# EAGLE board SBC_rev 3 (EAGLE 8.5.0)
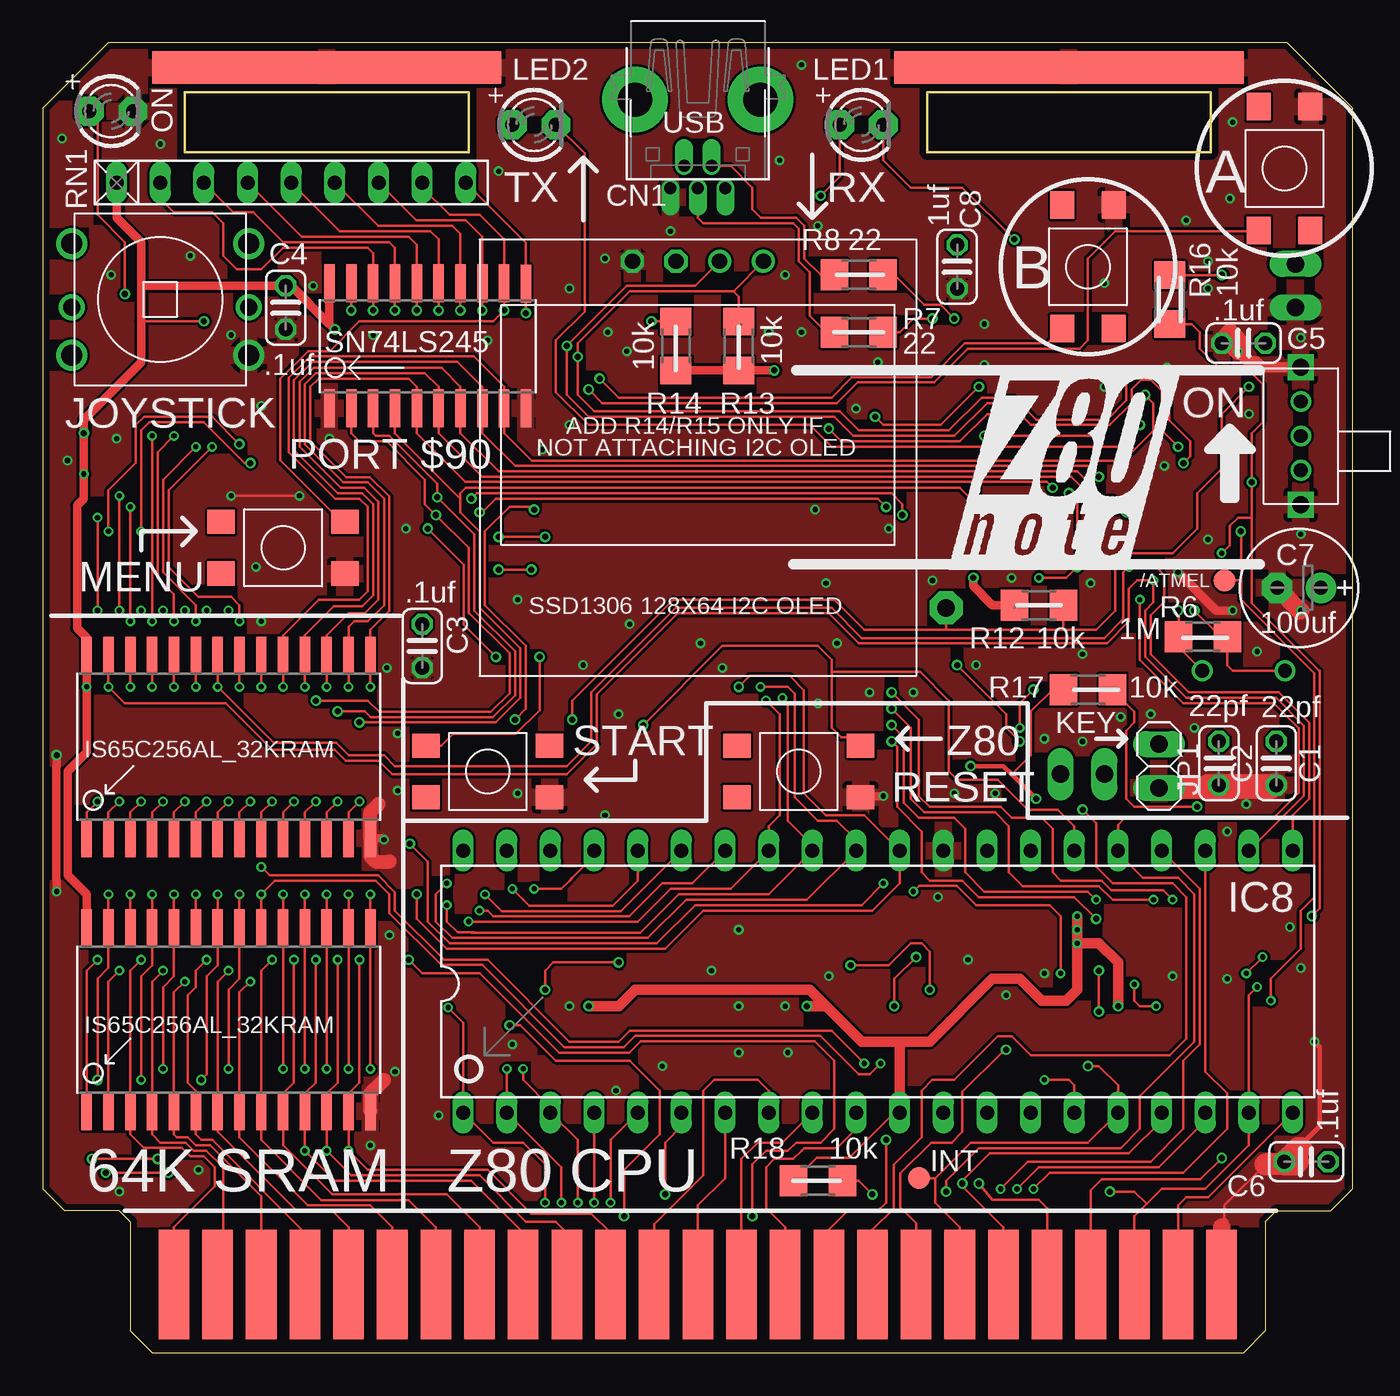
[diagram p2: board, top side]
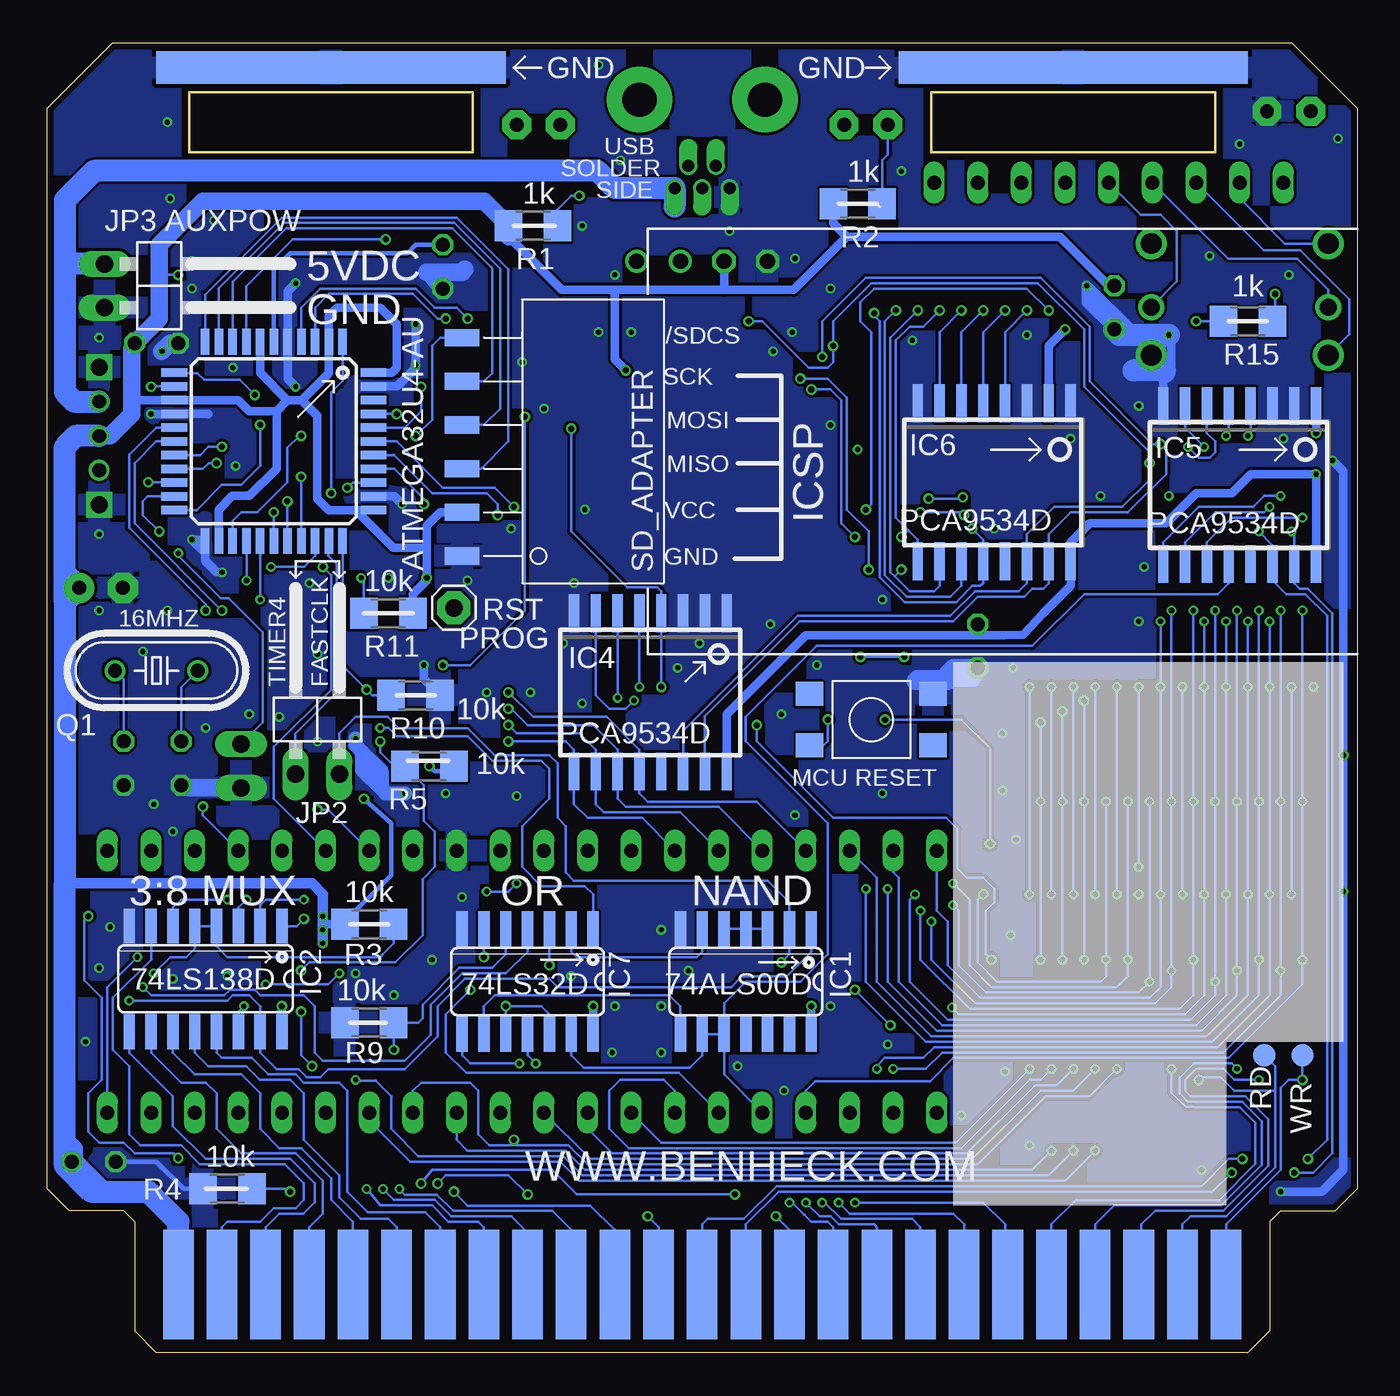
[diagram p3: board, bottom side, seen from below]

Size 76.2 x 76.2 mm. Coordinates in mm from the lower left corner, seen from the top.
Outline: 6.35,0 69.85,0 71.12,1.27 71.12,7.62 71.75,8.26 74.93,8.26 76.2,9.53 76.2,72.39 72.39,76.2 3.81,76.2 0,72.39 0,9.53 1.27,8.26 4.45,8.26 5.08,7.62 5.08,1.27 6.35,0
Outline: 8.26,69.85 24.77,69.85 24.77,73.34 8.26,73.34 8.26,69.85
Outline: 51.44,69.85 67.94,69.85 67.94,73.34 51.44,73.34 51.44,69.85
Copper layers (1*16): Top 0.035559375mm / dielectric 1.6mm / Bottom 0.035559375mm
Design rules "oshpark-2layer": minimum track width 6mil, minimum drill 10mil, track to track 6mil, track to pad 6mil, pad to pad 6mil, via to via 6mil, smd to smd 6mil, copper to edge 15mil, drill to drill 6mil, minimum pad ring 5mil, minimum via ring 5mil, stop-mask expansion 2.5mil, vias tented up to drill 0mil, thermal gap 10mil

## Footprints (pad centres in the part's own frame; a part is rotated, then mirrored left to right if it is on the bottom)
B1,27 = smd 1.27 x 1.27: TP 0,0
RESISTOR_C025-024X044 = drill 0.813 octagon: 1 -1.27,0; 2 1.27,0
E2,5-7 = drill 0.813 pad 1.778: + -1.27,0 | drill 0.813 pad 1.778 octagon: - 1.27,0
USB-MINIB-THM-MOLEX = drill 0.7 offset: D+ 0,9.72; D- -0.8,8.42; GND 1.6,9.72; ID 0.8,8.42; VBUS -1.6,9.72 | drill 2 pad 3.81: GND1 -3.65,4.57; GND4 3.65,4.57
SO14 = smd 0.66 x 2.032: 1 -3.81,-3.073; 2 -2.54,-3.073; 3 -1.27,-3.073; 4 0,-3.073; 5 1.27,-3.073; 6 2.54,-3.073; 7 3.81,-3.073; 8 3.81,3.073; 9 2.54,3.073; 10 1.27,3.073; 11 0,3.073; 12 -1.27,3.073; 13 -2.54,3.073; 14 -3.81,3.073
SO16 = smd 0.66 x 2.032: 1 -4.445,-3.073; 2 -3.175,-3.073; 3 -1.905,-3.073; 4 -0.635,-3.073; 5 0.635,-3.073; 6 1.905,-3.073; 7 3.175,-3.073; 8 4.445,-3.073; 9 4.445,3.073; 10 3.175,3.073; 11 1.905,3.073; 12 0.635,3.073; 13 -0.635,3.073; 14 -1.905,3.073; 15 -3.175,3.073; 16 -4.445,3.073
SO16W = smd 0.6 x 2.2: 1 -4.445,-4.6; 2 -3.175,-4.6; 3 -1.905,-4.6; 4 -0.635,-4.6; 5 0.635,-4.6; 6 1.905,-4.6; 7 3.175,-4.6; 8 4.445,-4.6; 9 4.445,4.6; 10 3.175,4.6; 11 1.905,4.6; 12 0.635,4.6; 13 -0.635,4.6; 14 -1.905,4.6; 15 -3.175,4.6; 16 -4.445,4.6
DIL40 = drill 0.813 long: 1 -24.13,-7.62; 2 -21.59,-7.62; 3 -19.05,-7.62; 4 -16.51,-7.62; 5 -13.97,-7.62; 6 -11.43,-7.62; 7 -8.89,-7.62; 8 -6.35,-7.62; 9 -3.81,-7.62; 10 -1.27,-7.62; 11 1.27,-7.62; 12 3.81,-7.62; 13 6.35,-7.62; 14 8.89,-7.62; 15 11.43,-7.62; 16 13.97,-7.62; 17 16.51,-7.62; 18 19.05,-7.62; 19 21.59,-7.62; 20 24.13,-7.62; 21 24.13,7.62; 22 21.59,7.62; 23 19.05,7.62; 24 16.51,7.62; 25 13.97,7.62; 26 11.43,7.62; 27 8.89,7.62; 28 6.35,7.62; 29 3.81,7.62; 30 1.27,7.62; 31 -1.27,7.62; 32 -3.81,7.62; 33 -6.35,7.62; 34 -8.89,7.62; 35 -11.43,7.62; 36 -13.97,7.62; 37 -16.51,7.62; 38 -19.05,7.62; 39 -21.59,7.62; 40 -24.13,7.62
1X02 = drill 1.016 long: 1 -1.27,0; 2 1.27,0
1X02/90 = drill 1.016 long: 1 -1.27,-3.81; 2 1.27,-3.81
LED3MM = drill 0.813 pad 1.676 octagon: A -1.27,0; K 1.27,0
HC49/S = drill 0.813: 1 -2.413,0; 2 2.413,0
R1206 = smd 1.6 x 1.803: 1 -1.422,0; 2 1.422,0
RN-9 = drill 0.813 long: 1 -10.16,0; 2 -7.62,0; 3 -5.08,0; 4 -2.54,0; 5 0,0; 6 2.54,0; 7 5.08,0; 8 7.62,0; 9 10.16,0
1X01 = drill 1.016 pad 1.93 octagon: 1 0,0
SD_RIGHTANGLE = smd 1 x 2: P$1 -6.35,0; P$2 -3.81,0; P$3 -1.27,0; P$4 1.27,0; P$5 3.81,0; P$6 6.35,0
CARD50 = smd 1.778 x 6.35: P$1 -30.48,-3.81; P$3 -27.94,-3.81; P$5 -25.4,-3.81; P$7 -22.86,-3.81; P$9 -20.32,-3.81; P$11 -17.78,-3.81; P$13 -15.24,-3.81; P$15 -12.7,-3.81; P$17 -10.16,-3.81; P$19 -7.62,-3.81; P$21 -5.08,-3.81; P$23 -2.54,-3.81; P$25 0,-3.81; P$27 2.54,-3.81; P$29 5.08,-3.81; P$31 7.62,-3.81; P$33 10.16,-3.81; P$35 12.7,-3.81; P$37 15.24,-3.81; P$39 17.78,-3.81; P$41 20.32,-3.81; P$43 22.86,-3.81; P$45 25.4,-3.81; P$47 27.94,-3.81; P$49 30.48,-3.81 | smd 1.778 x 6.35 bottom: P$2 -30.48,-3.81; P$4 -27.94,-3.81; P$6 -25.4,-3.81; P$8 -22.86,-3.81; P$10 -20.32,-3.81; P$12 -17.78,-3.81; P$14 -15.24,-3.81; P$16 -12.7,-3.81; P$18 -10.16,-3.81; P$20 -7.62,-3.81; P$22 -5.08,-3.81; P$24 -2.54,-3.81; P$26 0,-3.81; P$28 2.54,-3.81; P$30 5.08,-3.81; P$32 7.62,-3.81; P$34 10.16,-3.81; P$36 12.7,-3.81; P$38 15.24,-3.81; P$40 17.78,-3.81; P$42 20.32,-3.81; P$44 22.86,-3.81; P$46 25.4,-3.81; P$48 27.94,-3.81; P$50 30.48,-3.81
TQFP44 = smd 1.5 x 0.5: 1 -5.8,4; 2 -5.8,3.2; 3 -5.8,2.4; 4 -5.8,1.6; 5 -5.8,0.8; 6 -5.8,0; 7 -5.8,-0.8; 8 -5.8,-1.6; 9 -5.8,-2.4; 10 -5.8,-3.2; 11 -5.8,-4; 23 5.8,-4; 24 5.8,-3.2; 25 5.8,-2.4; 26 5.8,-1.6; 27 5.8,-0.8; 28 5.8,0; 29 5.8,0.8; 30 5.8,1.6; 31 5.8,2.4; 32 5.8,3.2; 33 5.8,4 | smd 0.5 x 1.5: 12 -4,-5.8; 13 -3.2,-5.8; 14 -2.4,-5.8; 15 -1.6,-5.8; 16 -0.8,-5.8; 17 0,-5.8; 18 0.8,-5.8; 19 1.6,-5.8; 20 2.4,-5.8; 21 3.2,-5.8; 22 4,-5.8; 34 4,5.8; 35 3.2,5.8; 36 2.4,5.8; 37 1.6,5.8; 38 0.8,5.8; 39 0,5.8; 40 -0.8,5.8; 41 -1.6,5.8; 42 -2.4,5.8; 43 -3.2,5.8; 44 -4,5.8
SO28-3 = smd 0.61 x 2.21: 1 -8.255,-5.315; 2 -6.985,-5.315; 3 -5.715,-5.315; 4 -4.445,-5.315; 5 -3.175,-5.315; 6 -1.905,-5.315; 7 -0.635,-5.315; 8 0.635,-5.315; 9 1.905,-5.315; 10 3.175,-5.315; 11 4.445,-5.315; 12 5.715,-5.315; 13 6.985,-5.315; 14 8.255,-5.315; 15 8.255,5.315; 16 6.985,5.315; 17 5.715,5.315; 18 4.445,5.315; 19 3.175,5.315; 20 1.905,5.315; 21 0.635,5.315; 22 -0.635,5.315; 23 -1.905,5.315; 24 -3.175,5.315; 25 -4.445,5.315; 26 -5.715,5.315; 27 -6.985,5.315; 28 -8.255,5.315
6MM_TACT = smd 1.6 x 1.4: P$1 -3.6,1.5; P$2 3.6,1.5; P$3 -3.6,-1.5; P$4 3.6,-1.5
GND_PADS = smd 20.32 x 1.905: P$1 0,0
OLED_128X64_I2C = drill 0.9 octagon: P$1 -3.81,-1.27; P$2 -1.27,-1.27 | drill 0.9: P$3 1.27,-1.27; P$4 3.81,-1.27
SKQUCAA010 = drill 1.2: COM 5.15,-3.25; DOWN -5.15,-3.25; P$4 5.15,3.25; UP -5.15,3.25 | drill 1: LEFT -5.15,-0.45; RIGHT 5.15,-0.45
SO20L = smd 0.61 x 2.21: 1 -5.715,-3.635; 2 -4.445,-3.635; 3 -3.175,-3.635; 4 -1.905,-3.635; 5 -0.635,-3.635; 6 0.635,-3.635; 7 1.905,-3.635; 8 3.175,-3.635; 9 4.445,-3.635; 10 5.715,-3.635; 11 5.715,3.61; 12 4.445,3.635; 13 3.175,3.635; 14 1.905,3.635; 15 0.635,3.635; 16 -0.635,3.635; 17 -1.905,3.635; 18 -3.175,3.635; 19 -4.445,3.635; 20 -5.715,3.635
SWITCH = drill 1 square: P$1 -4,0; P$5 4,0 | drill 0.8: P$2 -2,0; P$3 0,0; P$4 2,0

## Placement (x,y rotation side)
/ATMEL  TPB1,27  [B1,27]  68.74,44.93 0 top
C1  22pf  [RESISTOR_C025-024X044]  71.75,34.29 270 top
C2  22pf  [RESISTOR_C025-024X044]  68.42,34.29 270 top
C3  .1uf  [RESISTOR_C025-024X044]  22.07,41.12 270 top
C4  .1uf  [RESISTOR_C025-024X044]  14.13,60.8 270 top
C5  .1uf  [RESISTOR_C025-024X044]  69.85,58.74 180 top
C6  .1uf  [RESISTOR_C025-024X044]  73.5,11.11 180 top
C7  100uf  [E2,5-7]  73.08,44.5 180 top
C8  1uf  [RESISTOR_C025-024X044]  53.18,63.18 270 top
CN1  [USB-MINIB-THM-MOLEX]  38.1,77.47 180 top
IC1  74ALS00D  [SO14]  35.56,21.59 180 bottom
IC2  74LS138D  [SO16]  66.99,21.75 180 bottom
IC4  PCA9534D  [SO16W]  41.12,38.42 180 bottom
IC5  PCA9534D  [SO16W]  6.83,50.48 180 bottom
IC6  PCA9534D  [SO16W]  21.11,50.64 180 bottom
IC7  74LS32D  [SO14]  48.26,21.59 180 bottom
IC8  [DIL40]  48.58,21.59 0 top
INT  TPB1,27  [B1,27]  50.96,10.16 0 top
JP1  KEY  [1X02]  64.93,34.13 270 top
JP2  FASTCLK  [1X02/90]  60.48,37.47 0 bottom
JP3  [1X02/90]  69.06,62.07 270 bottom
LED1  [LED3MM]  47.62,71.44 0 top
LED2  [LED3MM]  28.57,71.44 0 top
ON  [LED3MM]  3.97,72.23 0 top
Q1  [HC49/S]  69.85,39.69 180 bottom
R1  1k  [R1206]  47.94,65.56 180 bottom
R2  1k  [R1206]  29.05,66.83 180 bottom
R3  10k  [R1206]  57.47,24.92 180 bottom
R4  10k  [R1206]  65.72,9.53 0 bottom
R5  10k  [R1206]  53.98,34.13 0 bottom
R6  1M  [R1206]  67.5,41.66 0 top
R7  22  [R1206]  47.47,59.37 0 top
R8  22  [R1206]  47.47,62.71 0 top
R9  10k  [R1206]  57.47,19.21 0 bottom
R10  10k  [R1206]  54.77,38.26 180 bottom
R11  10k  [R1206]  56.36,43.02 0 bottom
R12  10k  [R1206]  57.94,43.5 180 top
R13  10k  [R1206]  40.48,58.58 270 top
R14  10k  [R1206]  36.83,58.58 270 top
R15  1k  [R1206]  6.35,60.01 0 bottom
R16  10k  [R1206]  65.56,61.28 90 top
R17  10k  [R1206]  60.8,38.58 180 top
R18  10k  [R1206]  45.09,10 180 top
RD  TPB1,27  [B1,27]  5.4,17.3 0 bottom
RN1  [RN-9]  14.45,68.07 0 top
RST  PROG  [1X01]  52.55,43.34 0 bottom
SD_ADAPTER  SD_ADAPTER  [SD_RIGHTANGLE]  52.07,52.7 90 bottom
U$1  CARDSLOT50  [CARD50]  38.1,7.78 0 top
U$2  ATMEGA32U4-AU  [TQFP44]  63.02,53.02 270 bottom
U$3  IS65C256AL_32KRAM  [SO28-3]  10.79,19.37 0 top
U$4  IS65C256AL_32KRAM  [SO28-3]  10.79,35.24 0 top
U$5  TACT  [6MM_TACT]  25.88,33.81 0 top
U$6  TACT  [6MM_TACT]  13.97,46.83 0 top
U$7  TACT  [6MM_TACT]  60.8,63.18 90 top
U$8  TACT  [6MM_TACT]  72.23,68.9 90 top
U$9  GND_STRIP  [GND_PADS]  16.51,74.77 0 top
U$10  GND_STRIP  [GND_PADS]  59.69,74.77 0 top
U$11  GND_STRIP  [GND_PADS]  16.51,74.77 0 bottom
U$12  GND_STRIP  [GND_PADS]  59.69,74.77 0 bottom
U$13  OLED_SSD1306_I2C  [OLED_128X64_I2C]  38.1,64.77 0 top
U$14  SKQUCAA010  [SKQUCAA010]  6.83,61.28 0 top
U$15  [Z80LOGO]  52.7,45.56 0 top
U$16  SN74LS245  [SO20L]  22.38,58.58 0 top
U$17  TACT  [6MM_TACT]  43.97,33.81 0 top
U$18  SWITCH_1825232-1  [SWITCH]  73.18,53.34 90 top
U$19  TACT  [6MM_TACT]  28.26,36.83 180 bottom
WR  TPB1,27  [B1,27]  3.17,17.3 0 bottom

## Tracks (layer width: path | path; a pad name or v marks a point on that pad's centre or on a via)
$A0
  Bottom 0.152: IC2.13 66.36,17.46 66.04,17.14 64.29,17.14 63.34,16.19 61.75,16.19 61.28,15.72 59.21,15.72 58.74,15.24 58.74,9.37 57.55,8.18 54.21,8.18 53.34,7.3 U$1.P$38
$B0
  Bottom 0.152: IC2.12 67.63,17.46 66.83,16.66 64.62,16.66 63.83,15.88 62.07,15.88 61.28,15.08 61.28,12.38 59.21,10.32 59.21,9.04 57.96,7.78 56.36,7.78 55.88,7.3 U$1.P$40
$C0
  Bottom 0.152: IC2.11 68.9,17.46 67.63,16.19 64.93,16.19 63.82,15.08 63.82,13.02 62.71,11.91 61.44,11.91 59.69,10.16 59.69,8.89 58.42,7.62 U$1.P$42
$D0
  Bottom 0.152: IC2.10 70.17,17.46 68.42,15.72 66.99,15.72 66.36,15.08 66.36,13.02 64.93,11.59 61.75,11.59 60.17,10 60.17,8.1 60.96,7.3 U$1.P$44
$E0
  Bottom 0.152: IC2.9 71.44,17.46 68.9,14.92 68.9,13.18 66.99,11.27 62.07,11.27 60.66,9.86 60.66,8.76 61.32,8.1 62.71,8.1 63.5,7.3 U$1.P$46
$F0
  Bottom 0.152: IC2.7 70.17,22.86 72.39,20.64 72.39,17.62 71.44,16.67 71.44,12.7 70.8,12.06 68.42,12.06 67.32,10.97 62.39,10.97 61.28,9.86 61.28,8.89 61.75,8.41 63.02,8.41 63.82,7.62 65.72,7.62 66.04,7.3 U$1.P$48
/ATMELSERIAL  (via drill 0.3, 0.35)
  Top 0.152: v69.69,47.78 69.71,47.73 69.71,44.93 | v71.44,20.48 71.44,21.75 73.18,23.5 73.18,25.72 73.98,26.51 73.98,39.53 73.18,40.32 | 73.18,40.32 69.71,43.79 69.71,44.93 | /ATMEL.TP 69.71,44.93 | 73.18,40.32
  Bottom 0.152: IC1.1 31.75,23.34 33.19,21.89 35.79,21.89 36.41,21.27 46.51,21.27 46.99,21.75 51.91,21.75 53.5,20.16 53.5,18.41 55.42,16.5 59.86,16.5 60.33,16.03 61.12,16.03 61.58,16.5 62.85,16.5 63.82,17.46 IC2.15 63.82,20.16 64.45,20.8 65.41,20.8 65.72,20.48 v71.44,20.48 | v69.69,47.78 70.64,48.74 70.64,49.53 70.35,49.82 U$2.21
/BUSREQ  (via drill 0.3, 0.35)
  Top 0.152: v52.55,9.37 52.55,10 54.45,11.91 62.71,11.91 63.82,13.02 63.82,14.92 66.99,18.1 66.99,26.67 66.04,27.62 63.98,27.62 62.55,29.05 IC8.25 62.55,30.72 62.94,31.11 71.6,31.11 73.06,32.58 73.06,36.32 71.6,37.78 66.36,37.78 63.82,40.32 v63.82,43.81
  Bottom 0.152: v63.82,43.81 63.82,44.93 U$2.27 | U$1.P$30 43.18,7.14 43.19,7.14 44.61,8.56 51.74,8.56 v52.55,9.37
/BUTTONS  (via drill 0.3, 0.35)
  Top 0.152: U$16.19 v17.94,60.64 | v21.35,29.61 22.38,28.57 22.38,25.08 23.65,23.81 35.72,23.81 37.94,26.04 47.62,26.04 v48.9,27.3 | v28.57,49.05 28.42,49.21 27.15,49.21 25.72,47.78 25.72,43.5 28.1,41.12 28.1,37.47 v27.46,36.83 | v59.21,22.07 59.21,25.4 58.58,26.04 54.29,26.04 53.17,27.16 50.97,27.16 v50.64,26.83 | v63.5,21.43 63.5,20.48 63.82,20.16 v64.77,20.16
  Bottom 0.152: v28.57,49.05 28.26,49.37 28.26,59.37 28.89,60.01 28.89,61.12 28.1,61.91 19.21,61.91 v17.94,60.64 | v59.21,22.07 59.85,21.43 v63.5,21.43 | 49.29,26.91 v48.9,27.3 49.37,26.83 v50.64,26.83 | v64.77,20.16 65.09,19.84 IC2.14 | v27.46,36.83 23.02,36.83 21.35,35.16 v21.35,29.61
/HIGH32KRAM  (via drill 0.3)
  Top 0.152: U$3.20 v12.7,26.67 13.49,27.46 19.37,27.46 20.16,26.67 20.16,25.56 23.16,22.55 25.55,22.55 30.33,17.77 33.79,17.77 34.45,18.43 45.23,18.43 47.47,16.19 48.1,16.19 v48.74,16.83
  Bottom 0.152: IC7.8 52.07,17.3 51.59,16.83 v48.74,16.83
/IOREQ  (via drill 0.3)
  Top 0.152: v70.01,22.07 v70.96,23.02 | IC8.20 67.79,9.05 66.52,9.05 66.04,8.57 U$1.P$47
  Bottom 0.152: v70.96,23.02 72.71,21.27 IC8.20 | R3.1 56.05,23.81 56.67,23.18 56.83,23.02 65.72,23.02 66.36,23.65 IC2.4 IC2.5 67.63,23.5 68.1,23.02 69.06,23.02 v70.01,22.07
/LOW32KRAM  (via drill 0.3)
  Top 0.152: v12.7,38.73 U$4.20 | v47.78,16.83 45.88,18.73 34.13,18.73 33.5,18.1 30.63,18.1 25.88,22.85 25.56,22.86 23.34,22.86 20.48,25.72 20.48,26.78 19.49,27.77 13.19,27.77 v12.7,28.26
  Bottom 0.152: IC7.11 48.26,17.3 v47.78,16.83 | v12.7,28.26 v12.7,38.73
/LOW64K  (via drill 0.35)
  Top 0.152: v56.04,17.62 56.04,17.46 55.79,17.46 53.5,15.17 53.5,12.86 52.86,12.22 51.67,12.22 49.89,10.44 49.89,8.45 50.8,7.54 U$1.P$35
  Bottom 0.152: IC7.5 49.53,23.18 50.32,22.38 52.23,22.38 54.37,20.24 54.37,19.45 54.61,19.21 R9.2 v56.05,17.63 v56.04,17.62
/MREQ  (via drill 0.3, 0.35)
  Top 0.152: v70.64,21.27 70.17,20.8 IC8.19 70.17,12.06 67.63,9.53 65.09,9.53 64.21,8.65 | U$1.P$45 63.5,7.94 64.21,8.65 | v62.07,9.37 63.5,9.37 64.21,8.65
  Bottom 0.152: IC7.4 48.26,23.34 49.53,22.07 52.07,22.07 53.9,20.24 53.9,18.49 55.4,16.99 60.17,16.99 60.64,17.46 60.64,20.16 61.28,20.8 63.82,20.8 64.14,21.11 65.56,21.11 65.89,20.78 70.16,20.78 v70.64,21.27 | R4.2 62.23,9.53 v62.07,9.37
/SDCS  (via drill 0.35)
  Top 0.152: v54.77,53.34 v61.44,53.34
  Bottom 0.152: U$2.25 65.42,48.4 64.93,48.9 63.98,48.9 62.23,50.64 62.23,52.64 61.53,53.34 v61.44,53.34 | v54.77,53.34 53.82,54.29 53.82,58.58 53.34,59.05 SD_ADAPTER.P$6
A  (via drill 0.35)
  Top 0.152: RN1.6 19.49,65.56 23.81,65.56 24.29,65.09 U$16.14 v24.29,60.64 | v31.75,56.04 32.54,55.24 46.2,55.24 47.4,56.45 51.84,56.45 53.81,58.41 60.33,58.41 60.8,58.89 60.8,62.71 60.8,63.66 61.75,64.61 | v29.21,47.47 v26.51,47.47 26.35,47.62 | U$8.P$1 70.68,65.25 62.39,65.25 61.75,64.61 | 61.75,64.61
  Bottom 0.152: IC6.9 25.56,47.31 26.11,47.86 | v24.29,60.64 25.24,59.69 26.04,59.69 26.83,58.9 26.83,48.58 26.11,47.86 | v31.75,56.04 30.64,56.04 30,55.4 30,48.26 v29.21,47.47 | 26.11,47.86 v26.51,47.47
A0  (via drill 0.3, 0.35)
  Top 0.152: v14.61,32.07 13.97,31.43 U$4.10 | v14.61,22.86 14.61,15.72 13.97,15.08 U$3.10 13.97,12.06 16.83,9.21 23.5,9.21 25.4,7.3 U$1.P$15 | v21.75,26.67 21.75,25.24 23.5,23.5 36.2,23.5 38.42,25.72 48.26,25.72 49.85,27.3 IC8.30 47.78,31.27 45.54,31.27 44.27,32.54 44.27,38.55 43.45,39.37 41.12,39.37 v40.48,38.73 | v55.88,54.61 54.93,54.61 53.34,53.02 46.46,53.02 v45.72,53.76
  Bottom 0.152: v14.61,32.07 v14.61,22.86 14.61,21.91 14.92,21.59 20.95,21.59 22.07,22.7 22.07,26.35 v21.75,26.67 | v40.48,38.73 IC4.4 40.48,44.29 40.72,44.53 42.47,44.53 45.72,47.78 v45.72,53.76 | U$2.41 55.89,54.62 v55.88,54.61
A1  (via drill 0.3)
  Top 0.152: v13.34,22.86 12.7,22.23 U$3.9 12.7,12.38 16.2,8.88 21.29,8.88 22.86,7.3 U$1.P$13 | v13.34,32.07 12.7,31.43 U$4.9 | v23.5,27.3 22.86,26.67 22.86,25.08 23.81,24.13 35.2,24.13 37.42,26.35 44.45,26.35 IC8.31 47.31,29.84 46.2,30.96 45.09,30.96 43.74,32.31 43.74,38.34 43.34,38.73 v41.75,38.73
  Bottom 0.152: v13.34,32.07 v13.34,22.86 13.34,21.91 13.97,21.27 21.27,21.27 22.54,22.54 22.54,26.35 v23.5,27.3 | IC4.5 v41.75,38.73
A2  (via drill 0.3)
  Top 0.152: v12.06,21.59 11.43,20.95 U$3.8 11.43,12.54 15.4,8.57 19.05,8.57 20.32,7.3 U$1.P$11 | U$4.8 11.43,31.43 v12.06,32.07 | v23.5,26.04 23.5,25.08 24.13,24.45 24.92,24.45 | v43.02,38.1 43.34,37.78 43.34,30.96 44.77,29.53 IC8.32 42.23,26.67 36.99,26.67 34.75,24.43 24.94,24.43 24.92,24.45 | 25.08,24.45 24.92,24.45
  Bottom 0.152: v12.06,32.07 v12.06,21.59 12.7,20.95 21.59,20.95 23.18,22.54 23.18,25.72 v23.5,26.04 | IC4.6 v43.02,38.1
A3  (via drill 0.3)
  Top 0.152: v10.79,22.23 10.16,21.59 U$3.7 10.16,12.86 14.76,8.26 16.83,8.26 17.78,7.3 U$1.P$9 17.78,6.99 | v10.79,32.07 10.16,31.43 U$4.7 | v42.07,37.94 42.86,37.15 42.86,31.27 42.23,30.64 IC8.33 40.01,26.99 36.51,26.99 34.61,25.08 v24.77,25.08
  Bottom 0.152: v10.79,43.18 v10.79,32.07 v10.79,22.23 10.79,21.27 11.75,20.32 22.23,20.32 24.77,22.86 v24.77,25.08 | IC4.7 44.29,38.26 43.5,37.47 42.55,37.47 v42.07,37.94
A4  (via drill 0.3, 0.35)
  Top 0.152: v9.53,22.86 8.89,22.23 8.89,21.27 8.41,20.8 8.41,15.72 8.89,15.24 U$3.6 8.89,12.7 9.21,12.38 9.84,12.38 15.24,6.99 U$1.P$7 | v9.53,32.07 8.89,31.43 U$4.6 | IC8.34 37.78,27.3 36.04,27.3 34.12,25.39 26.19,25.39 25.86,25.72 v25.4,25.72 | v49.37,35.56 49.69,35.24 49.69,31.75 51.12,30.32 51.12,27.94 51.59,27.46 53.5,27.46 54.45,26.51 60.01,26.51 v61.28,25.24
  Bottom 0.152: v25.4,25.72 25.4,22.86 22.54,20 10.32,20 9.53,20.8 v9.53,22.86 v9.53,32.07 v9.53,43.18 | IC8.34 41.59,31.11 44.77,31.11 45.56,31.91 IC4.9 45.56,35.08 46.04,35.56 v49.37,35.56 | IC2.1 61.7,24.82 v61.28,25.24
A5  (via drill 0.3, 0.35)
  Top 0.152: v8.26,21.59 7.62,20.95 U$3.5 7.62,12.7 7.78,12.54 8.41,12.54 8.89,12.06 9.73,12.06 12.7,9.09 U$1.P$5 | v8.26,32.07 7.62,31.43 U$4.5 | v61.28,26.35 60.8,26.83 54.77,26.83 53.66,27.94 53.66,30.48 53.02,31.11 50.96,31.11 50.09,31.99 50.09,35.8 v49.37,36.51 | v25.72,26.67 26.7,25.69 33.63,25.69 IC8.35
  Bottom 0.152: v25.72,26.67 26.04,26.35 26.04,21.59 23.81,19.37 9.68,19.37 8.26,20.8 v8.26,21.59 v8.26,32.07 v8.26,43.18 | IC8.35 39.37,31.43 43.81,31.43 44.29,31.91 IC4.10 44.29,35.08 45.24,36.04 48.9,36.04 v49.37,36.51 | v61.28,26.35 63.5,26.35 63.82,26.04 IC2.2
A6  (via drill 0.3, 0.35)
  Top 0.152: v6.99,22.23 6.35,21.59 U$3.4 6.35,12.7 6.83,12.22 8.3,12.22 8.76,11.76 9.51,11.76 10.48,10.79 10.48,4.29 U$1.P$3 | v6.99,32.07 6.35,31.43 U$4.4 | v49.37,37.47 50.48,36.35 50.48,32.23 51.28,31.43 55.4,31.43 56.2,30.64 56.2,27.94 56.99,27.15 61.44,27.15 62.23,26.35 v64.61,26.35 | IC8.36 34.61,27.46 33.14,26 28.3,26 27.94,26.35 v27.3,26.99
  Bottom 0.152: v27.3,26.99 27.3,21.59 24.45,18.73 9.05,18.73 6.99,20.8 v6.99,22.23 v6.99,32.07 v6.99,43.18 | IC8.36 37.15,31.75 42.55,31.75 43.02,32.23 IC4.11 43.02,35.08 44.45,36.51 48.26,36.51 49.21,37.47 v49.37,37.47 | v64.61,26.35 65.09,25.88 IC2.3
A7  (via drill 0.3, 0.35)
  Top 0.152: v5.71,22.86 5.08,22.23 U$3.3 5.08,12.7 5.86,11.92 8.08,11.92 8.57,11.43 9.37,11.43 10,10.79 10,9.68 7.62,7.3 U$1.P$1 | v5.71,32.07 5.08,31.43 U$4.3 | IC8.37 32.07,28.89 30.8,27.62 30.64,27.46 | v28.57,26.99 30.16,26.99 30.64,27.46 | v49.37,38.42 50.96,36.83 50.96,32.38 51.59,31.75 55.72,31.75 56.36,31.11 58.1,31.11 58.74,30.48 58.74,27.94 59.21,27.46 61.59,27.46 62.15,26.91 65.17,26.91 v65.72,26.35 | 30.64,27.46
  Bottom 0.152: v28.57,26.99 28.57,21.59 25.08,18.1 8.41,18.1 5.71,20.8 v5.71,22.86 v5.71,32.07 v5.71,43.18 | IC8.37 34.92,32.07 41.27,32.07 41.75,32.54 IC4.12 41.75,35.08 43.66,36.99 47.94,36.99 v49.37,38.42 | IC2.6 68.9,25.88 68.42,26.35 v65.72,26.35
A8  (via drill 0.3)
  Top 0.152: v6.35,26.67 U$3.25 6.35,22.54 5.71,21.91 v5.71,15.88 | v6.35,38.73 U$4.25 | v6.35,42.55 v6.35,53.34
  Bottom 0.152: IC8.38 27.94,27.62 27.94,21.59 24.77,18.41 8.73,18.41 6.35,20.8 v6.35,26.67 v6.35,38.73 v6.35,42.55 | v6.35,53.34 6.19,53.5 IC5.4 | v5.71,15.88 7.14,15.88 7.78,16.51 9.37,16.51 10,15.88 10,15.24 9.68,14.92 6.51,14.92 5.16,13.57 5.16,10.87 7.78,8.26 11.75,8.26 12.54,7.46 12.54,4.13 U$1.P$6
A9  (via drill 0.3)
  Top 0.152: v7.62,26.67 U$3.24 7.62,21.91 6.99,21.27 v6.99,16.51 | v7.62,38.73 U$4.24 | v7.62,42.55 7.62,44.13 6.67,45.09 6.67,52.39 v7.62,53.34
  Bottom 0.152: IC8.39 26.99,27.94 26.67,27.62 26.67,21.59 24.13,19.05 9.37,19.05 7.62,20.8 v7.62,26.67 v7.62,38.73 v7.62,42.55 | v7.62,53.34 7.46,53.5 IC5.5 | v6.99,16.51 7.3,16.83 9.53,16.83 9.53,16.78 10.31,16 10.31,15.09 10.32,15.08 9.84,14.61 6.67,14.61 5.53,13.47 5.53,10.93 7.89,8.57 14.13,8.57 15.24,7.46 U$1.P$8
A10  (via drill 0.3)
  Top 0.152: v11.43,26.67 U$3.21 11.43,21.75 10.79,21.11 v10.79,16.51 | U$4.21 v11.43,38.73 | v11.43,42.55 11.43,43.5 10.95,43.97 9.05,43.97 7.32,45.71 7.32,50.18 v9.84,52.7
  Bottom 0.152: IC8.40 24.45,25.72 23.81,25.08 23.81,22.54 21.91,20.64 12.06,20.64 11.43,21.27 v11.43,26.67 v11.43,38.73 v11.43,42.55 | v9.84,52.7 9.21,52.07 8.57,52.07 8.26,52.39 8.26,53.02 8.73,53.5 IC5.6 | U$1.P$10 17.78,7.46 16.36,8.88 8.02,8.88 5.91,10.99 5.91,13.37 6.83,14.29 9.53,14.29 9.54,14.3 9.97,14.3 10.79,15.13 v10.79,16.51
A11  (via drill 0.3)
  Top 0.152: U$3.23 v8.89,26.67 | v8.89,38.73 U$4.23 | v8.89,42.55 8.89,43.5 6.99,45.4 6.99,50.8 v8.89,52.7 | v23.57,20.08 24.45,19.21 IC8.1 26.19,12.22 27.94,12.22 29.21,10.95 v29.21,8.73
  Bottom 0.152: v8.89,42.55 v8.89,38.73 v8.89,26.67 8.89,20.8 10,19.68 23.18,19.68 v23.57,20.08 | v8.89,52.7 10,53.82 IC5.7 | 29.05,8.73 v29.21,8.73 21.75,8.73 20.48,7.46 20.48,4.13 U$1.P$12
A12  (via drill 0.3)
  Top 0.152: U$3.2 3.81,21.59 v4.45,22.23 | v4.45,32.07 3.81,31.43 U$4.2 | v26.99,16.51 IC8.2 30.16,10.79 v30.16,8.73 | v4.45,49.85 v4.45,43.18
  Bottom 0.152: v4.45,43.18 v4.45,32.07 v4.45,22.23 4.45,20.8 7.78,17.46 24.13,17.46 25.08,16.51 v26.99,16.51 | IC5.9 11.27,47.15 9.21,49.21 6.03,49.21 5.4,49.85 v4.45,49.85 | v30.16,8.73 29.53,8.1 23.5,8.1 22.86,7.46 U$1.P$14
A13  (via drill 0.3)
  Top 0.152: U$3.26 v5.08,26.67 | v5.08,38.73 U$4.26 | v27.94,16.51 27.94,15.88 29.53,14.29 IC8.3 31.11,12.38 v31.11,8.73 | v5.08,49.21 v5.08,42.55
  Bottom 0.152: v5.08,42.55 v5.08,38.73 v5.08,26.67 5.08,20.8 8.1,17.78 24.61,17.78 25.24,17.14 27.46,17.14 27.94,16.67 v27.94,16.51 | IC5.10 10,47.15 8.26,48.9 5.4,48.9 v5.08,49.21 | v31.11,8.73 30.96,8.73 30,7.78 25.88,7.78 25.4,7.3 U$1.P$16
A14  (via drill 0.3)
  Top 0.152: U$3.1 2.54,22.23 v3.17,22.86 | U$4.1 2.54,31.43 v3.17,32.07 | IC8.4 v32.07,8.73 | v3.17,48.58 v3.17,43.18
  Bottom 0.152: IC8.4 32.07,15.24 31.51,15.8 24.84,15.8 23.5,17.14 7.46,17.14 3.17,21.43 v3.17,22.86 v3.17,32.07 v3.17,43.18 | IC5.11 8.73,47.15 7.3,48.58 v3.17,48.58 | v32.07,8.73 31.26,7.92 30.63,7.92 30.16,7.46 28.1,7.46 27.94,7.3 U$1.P$18
A15  (via drill 0.3)
  Top 0.152: IC8.5 33.02,12.38 v33.02,8.73
  Bottom 0.152: U$1.P$20 30.48,7.3 30.8,7.62 31.75,7.62 32.15,8.03 | 32.15,8.03 32.13,8.01 | IC1.10 IC1.9 38.1,17.3 38.83,16.58 44.99,16.58 45.72,17.3 IC7.13 | IC1.10 36.83,16.19 IC8.5 | IC5.12 7.46,44.77 8.1,44.13 15.88,44.13 18.89,41.12 31.43,41.12 35.56,36.99 35.56,35.56 30.8,30.8 30.8,23.18 32.38,21.59 35.56,21.59 36.83,20.32 IC1.10 | v33.02,8.73 32.86,8.73 32.15,8.03
B  (via drill 0.35)
  Top 0.152: RN1.7 21.72,65.88 24.61,65.88 25.56,64.93 U$16.13 v25.56,60.64 | U$7.P$1 58.44,58.72 53.64,58.72 51.67,56.75 47.07,56.75 45.88,55.56 33.5,55.56 v32.38,56.67 | v28.42,45.56 v26.51,45.56
  Bottom 0.152: v25.56,60.64 27.15,59.05 27.15,45.4 26.91,45.16 | 26.91,45.16 26.04,44.29 24.61,44.29 24.29,44.61 IC6.10 | v32.38,56.67 30.8,56.67 29.69,55.56 29.69,49.05 28.42,47.78 v28.42,45.56 | v26.51,45.56 26.91,45.16
BUSAK  (via drill 0.3)
  Top 0.152: v57.63,9.53 58.58,10.48 66.36,10.48 68.9,13.02 68.9,15.08 67.63,16.35 IC8.23
  Bottom 0.152: U$1.P$36 50.8,7.3 51.12,7.62 52.86,7.62 53.82,8.57 56.83,8.57 v57.63,9.53
D0  (via drill 0.3, 0.35)
  Top 0.152: U$4.11 15.24,31.43 v15.88,32.07 | U$1.P$17 27.94,6.99 24.92,10 16.99,10 v15.24,11.75 U$3.11 15.24,15.08 15.88,15.72 v15.88,22.86 | U$16.2 17.94,53.5 18.41,53.02 20,53.02 22.23,50.8 22.23,49.37 v22.86,48.74 24.78,46.82 24.78,43.02 24.81,43.02 27.15,40.69 27.15,38.37 26.05,37.28 19.55,37.28 18.89,37.94 v15.88,37.94 | v25.4,48.9 25.56,48.9 26.35,49.69 48.58,49.69 v49.05,49.21
  Bottom 0.152: v15.88,22.86 v15.88,32.07 v15.88,37.94 15.88,38.1 | v15.24,11.75 16.99,10 45.24,10 46.35,11.11 55.09,11.11 57.47,13.49 IC8.14 | v22.86,48.74 v22.87,48.74 23.03,48.9 v25.4,48.9 | U$2.39 55.88,53.02 53.18,50.32 50.16,50.32 v49.05,49.21
D1  (via drill 0.3, 0.35)
  Top 0.152: v17.14,32.07 16.51,31.43 U$4.12 | U$1.P$19 30.48,6.99 29.84,7.62 28.1,7.62 25.4,10.32 17.94,10.32 v16.51,11.75 U$3.12 16.51,15.08 17.14,15.72 v17.14,22.86 | v58.26,15.88 59.69,15.88 60.01,15.56 IC8.15 | U$16.3 19.21,53.5 19.37,53.34 20.16,53.34 22.94,50.56 v22.94,49.77 25.08,47.62 25.08,43.18 27.46,40.8 27.46,38.26 26.18,36.98 19.06,36.98 18.73,37.31 v17.14,37.31 | v24.92,49.69 25.24,50.01 49.37,50.01 50.01,49.37 v50.01,48.74
  Bottom 0.152: v17.14,22.86 v17.14,32.07 v17.14,37.31 | v16.51,11.75 17.94,10.32 45.09,10.32 46.2,11.43 54.61,11.43 56.2,13.02 56.2,14.92 57.09,15.81 58.13,15.81 v58.26,15.88 | v22.94,49.77 23.02,49.69 v24.92,49.69 | U$2.38 56.05,52.22 56.04,52.23 53.82,50.01 50.64,50.01 50.01,49.37 v50.01,48.74
D2  (via drill 0.3, 0.35)
  Top 0.152: v18.41,32.07 17.78,31.43 U$4.13 | U$1.P$21 33.02,6.99 31.91,8.1 28.42,8.1 25.88,10.64 18.89,10.64 v17.78,11.75 U$3.13 17.78,15.08 18.41,15.72 v18.41,22.86 | U$16.4 20.48,53.5 24.29,49.69 | v54.29,49.37 53.34,50.32 24.61,50.32 24.29,50.01 24.29,49.69 | v18.41,36.67 26.35,36.67 27.78,38.1 27.78,40.97 25.41,43.34 25.41,47.77 24.29,48.9 24.29,49.69
  Bottom 0.152: v18.41,22.86 v18.41,32.07 v18.41,36.67 | v17.78,11.75 18.89,10.64 44.93,10.64 46.05,11.76 51.77,11.76 52.39,12.38 IC8.12 | U$2.37 56.03,51.42 54.29,49.69 v54.29,49.37
D3  (via drill 0.3, 0.35)
  Top 0.152: v19.05,26.67 U$3.15 v19.05,16.51 | v19.05,38.73 U$4.15 19.05,42.07 20.15,43.17 20.15,49.81 19.02,50.95 17.63,50.95 15.56,53.02 15.56,56.2 16.03,56.67 21.27,56.67 21.75,56.2 U$16.5 21.75,53.5 24.58,50.67 58.4,50.67 v58.74,50.32 | 35.56,6.99 U$1.P$23 35.56,7.46 38.42,10.32 38.42,15.24 39.05,15.88 41.59,15.88 42.23,15.24 IC8.8
  Bottom 0.152: v19.05,26.67 v19.05,38.73 | v19.05,16.51 23.34,12.22 40.48,12.22 IC8.8 | v58.74,50.32 58.44,50.62 U$2.36
D4  (via drill 0.3, 0.35)
  Top 0.152: v17.78,26.67 U$3.16 v17.78,16.51 | v17.78,38.73 U$4.16 17.78,42.23 18.1,42.55 18.89,42.55 19.84,43.5 19.84,49.69 18.89,50.64 17.46,50.64 15.24,52.86 15.24,56.36 15.88,56.99 22.23,56.99 23.02,56.2 U$16.6 23.02,53.5 25.55,50.97 59.84,50.97 61.91,48.9 v63.02,48.9 | 38.1,6.67 U$1.P$25 38.1,8.57 39.69,10.16 IC8.7
  Bottom 0.152: v17.78,26.67 v17.78,38.73 | IC8.7 39.69,15.24 40.32,15.88 42.86,15.88 43.5,15.24 43.5,13.02 42.39,11.91 23.02,11.91 19.05,15.88 18.41,15.88 v17.78,16.51 | U$2.28 v63.02,48.9
D5  (via drill 0.3, 0.35)
  Top 0.152: v16.51,26.67 U$3.17 v16.51,16.51 | v16.51,38.73 U$4.17 16.51,41.75 17.78,43.02 18.73,43.02 19.51,43.8 19.51,49.5 18.7,50.31 17.33,50.31 14.94,52.7 14.94,56.48 15.75,57.3 23.19,57.3 24.29,56.2 U$16.7 24.29,53.5 26.51,51.28 60.17,51.28 61.91,49.53 v62.23,49.53 | IC8.9 43.02,12.22 41.59,12.22 40.64,11.27 U$1.P$27
  Bottom 0.152: v16.51,26.67 v16.51,38.73 | IC8.9 44.77,13.02 43.34,11.59 22.7,11.59 18.73,15.56 17.46,15.56 v16.51,16.51 | v62.23,49.53 U$2.29
D6  (via drill 0.3, 0.35)
  Top 0.152: v15.24,26.67 U$3.18 v15.24,16.51 | v15.24,38.73 U$4.18 15.24,41.75 16.93,43.44 18.57,43.44 19.21,44.08 19.21,49.37 18.57,50.01 17.14,50.01 14.61,52.55 14.61,56.58 15.68,57.66 24.1,57.66 25.56,56.2 U$16.8 25.56,53.5 27.46,51.59 60.8,51.59 v61.44,50.96 | U$1.P$29 43.18,7.3 42.07,8.41 42.07,10.79 42.55,11.27 43.66,11.27 44.13,11.75 | IC8.10 47.31,13.02 46.2,11.91 44.29,11.91 44.13,11.75 | 44.13,11.75
  Bottom 0.152: v15.24,26.67 v15.24,38.73 | v61.44,50.96 61.44,47.23 U$2.30 | IC8.10 44.61,11.27 22.38,11.27 18.41,15.24 16.51,15.24 v15.24,16.51
D7  (via drill 0.3, 0.35)
  Top 0.152: v13.97,26.67 U$3.19 v13.97,16.51 | v13.97,38.73 U$4.19 13.97,41.75 16.03,43.81 18.41,43.81 18.89,44.29 18.89,49.21 18.41,49.69 17,49.69 14.3,52.39 14.3,56.71 15.56,57.97 25.06,57.97 26.83,56.2 U$16.9 26.83,53.5 28.43,51.9 62.87,51.9 64.61,53.65 64.61,55.24 v64.14,55.72 | U$1.P$31 45.72,7.14 46.83,8.26 48.58,8.26 49.05,8.73 v49.05,12.38
  Bottom 0.152: v13.97,26.67 v13.97,38.73 | v13.97,16.51 15.56,14.92 18.1,14.92 22.07,10.95 44.77,10.95 45.88,12.06 49.05,12.06 | IC8.13 54.93,15.24 54.45,15.72 51.59,15.72 51.12,15.24 51.12,12.7 50.48,12.06 49.05,12.06 | U$2.12 68.79,56.99 67.47,56.99 67.07,56.59 65.01,56.59 v64.14,55.72 | v49.05,12.38 49.05,12.06
D+  (via drill 0.35)
  Top 0.152: 49.5,59.37 R7.2 49.85,59.37 50.64,60.17 v51.75,60.17
  Bottom 0.152: U$2.4 61.42,60.8 60.31,61.91 54.77,61.91 53.66,60.8 52.39,60.8 v51.75,60.17
D-  (via drill 0.35)
  Top 0.152: R8.2 49.53,62.71 51.28,60.96 52.23,60.96 v53.02,60.17
  Bottom 0.152: U$2.3 60.62,60.8 59.83,61.59 54.93,61.59 53.5,60.17 v53.02,60.17
DOWN  (via drill 0.35)
  Top 0.152: RN1.3 11.08,66.36 12.22,66.36 13.97,64.61 20.16,64.61 20.48,64.29 U$16.17 v20.48,60.64
  Bottom 0.152: U$14.DOWN 0.46,59.25 0.46,61.28 3.31,64.14 5.43,64.14 RN1.3 | IC6.5 21.75,59.37 v20.48,60.64
FASTCLK  (via drill 0.35)
  Top 0.152: v27.15,19.05 27.78,19.05 29.84,16.99 34.13,16.99 35.88,15.24 35.88,12.7 33.81,10.64 v33.81,7.94 | v29.21,21.11 29.21,22.23 29.69,22.7 v33.5,22.7
  Bottom 0.152: JP2.2 59.21,36.04 58.26,36.99 56.4,36.99 55.74,36.33 51.73,36.33 50.16,34.77 46.99,34.77 46.51,34.29 46.51,31.11 46.04,30.64 46.04,27.94 45.56,27.46 34.29,27.46 33.02,26.19 IC1.2 33.02,23.18 v33.5,22.7 | U$1.P$22 33.02,7.14 v33.81,7.94 | v27.15,19.05 v29.21,21.11
GND  (via drill 0.3, 0.35)
  Top 0.152: v10.95,49.85 v14.92,49.85 | U$1.P$49 68.74,4.13 68.74,8.57 71.28,11.11 C6.2
  Top 0.254: C6.2 74.3,13.18 74.3,17.78 v73.98,18.1
  Top 0.508: v48.9,32.38 47.65,32.38 U$17.P$4 | U$4.14 19.76,29.93 v19.84,29.84 | v66.04,45.4 68.26,43.18 v69.22,43.18 | v0.79,34.77 0.79,34.11 0.77,34.09 0.77,27.51 0.79,27.48 v0.79,26.83 | 68.58,7.3 68.74,7.62 68.58,7.46 68.58,7.3
  Top 0.61: U$18.P$5 70.93,57.34 70.59,57.68 70.11,57.68 v69.53,58.26
  Top 0.813: 20.16,28.57 19.37,28.57 19.05,28.89 U$4.14 19.05,31.43 19.53,31.91 | U$3.14 19.05,15.08 19.84,15.88
  Top 1.016: 68.58,7.3 U$1.P$49 | C7.- 73.13,43.18 v73.18,43.18 | v69.53,58.26 69.22,58.58 69.22,58.74 C5.2 69.06,59.37 69.53,58.9 v69.53,58.26
  Top 1.27: 72.23,10.95 73.18,11.91 73.03,11.91 C6.2 73.03,11.11 72.87,10.95 72.23,10.95 | 72.23,10.95 71.12,10.95 | 67.47,32.86 68.26,32.86 | 68.26,32.86 C2.2 | 67.47,32.86 67.79,33.02 C1.2 71.44,32.86 68.26,32.86 | JP1.2 67.47,32.86
  Bottom 0.254: C6.2 69.85,11.11 68.26,9.53 R4.1 | C4.2 11.27,59.53 10.79,59.05
  Bottom 0.508: v54.77,59.85 54.77,57.31 55.85,56.22 U$2.43 | v61.75,56.2 62.22,56.67 U$2.5 62.22,61.76 v61.75,62.23 | v70.17,54.61 68.84,54.61 U$2.15 66.85,54.62 66.83,54.61 | IC5.8 11.27,56.99 11.19,57.07 10.79,57.47 10.79,59.05 v10.95,59.21 10.95,59.05 U$14.COM | U$2.35 56.01,49.82 v55.56,49.37 | v54.29,40.01 54.29,39.2 R10.1 | v4.45,9.37 2.06,9.37 0.79,10.64 v0.79,26.83 v0.79,34.77 0.79,51.28 v1.43,51.91 | v66.04,45.4 66.36,45.4 67.02,46.07 U$2.23 67.11,47.31 v67.79,47.31 67.02,46.55 67.02,46.51
  Bottom 0.61: 15.72,61.59 15.72,61.12 C4.2 13.65,59.53 | 15.72,61.59 v15.72,62.07 13.18,59.53 13.65,59.53 | v10.95,59.21 11.27,59.53 | 15.72,61.59 13.65,59.53
  Bottom 0.813: v58.26,35.72 58.26,35.33 57.89,34.96 | 57.89,34.96 57.89,33.92 56.75,32.78 | 56.75,32.78 56.52,32.54 v55.4,32.54 | 57.89,34.96 56.76,33.83 56.76,33 56.75,33 56.75,32.78
  Bottom 1.016: C2.2 67.94,32.86 JP1.2 | C3.2 23.5,39.85 23.81,39.53 23.81,39.05 25.72,39.05 25.56,39.21 22.38,39.21 | C5.2 69.06,58.74 v69.53,58.26 | C8.2 53.98,62.87 | 53.98,62.87 54.13,62.87 | 53.98,62.87 52.07,62.87 51.91,63.02
  Bottom 1.27: v10.95,59.21 13.81,59.21 C4.2 14.05,59.45 | U$14.COM 11.19,57.24 | 11.19,57.24 11.19,57.07 | 11.19,57.24 11.29,57.15 13.02,57.15
  other vias: 45.72,21.91 68.9,30.32 53.82,22.86 40.48,24.61 30.64,20.16 16.67,53.18 21.11,47.94 73.18,59.05 73.18,47.62 72.55,24.77 27.3,17.94 20.64,32.7 20.64,36.04 40.48,17.46 58.26,22.07 20.48,16.35 64.45,37.15 60.48,35.56 73.18,22.38 50.64,38.42 45.09,37.78 39.53,39.85 27.62,32.54 31.43,40.01 56.04,20.8 46.2,41.27 33.5,37.15 4.29,53.18 65.41,57.31 12.7,42.55 12.38,45.72 45.56,44.77 43.18,20.16 33.34,15.24 43.34,17.46 29.05,52.55 30.64,53.98 25.88,58.9 19.21,59.21 30.64,61.91 32.86,59.37 6.83,70.33 70.01,31.91 23.02,13.81 32.7,31.27 52.07,26.51 65.72,21.91 68.9,21.75 62.71,36.99 40.48,20.16 44.13,74.93 42.86,69.37 69.22,71.6 20,39.85 27.62,43.81 12.7,55.09 20.16,24.29 53.02,32.54 60.96,44.77 45.09,65.56 43.18,62.71 54.77,57.47 69.06,67.15 60.48,40.64 51.75,44.93 32.7,63.66 26.51,68.74 36.51,65.25 44.13,59.37 44.93,49.05 47.31,54.93 48.58,57.63 34.13,42.39 38.26,41.27 48.1,38.42 66.99,36.35 9.05,10.64 19.05,12.06 49.21,47.94 42.23,59.37 33.97,58.26 70.64,40.8 65.25,51.59 66.52,65.88 1.11,70.64 56.36,45.09 38.89,22.23 36.04,16.67 67.79,63.5 67.79,61.91 3.97,62.71 8.57,63.82
  pour Bottom: -2.54,7.46 80.01,7.46 80.01,78.74 -2.54,78.74
  pour Top: -5.08,7.78 81.28,7.78 81.28,80.01 -5.08,80.01
HALT  (via drill 0.3)
  Top 0.152: IC8.18 67.63,13.49 64.93,10.79 57.94,10.79 v56.67,9.53
  Bottom 0.152: U$1.P$34 48.26,6.99 49.21,7.94 52.7,7.94 53.66,8.89 56.04,8.89 v56.67,9.53
INT  (via drill 0.35)
  Top 0.152: v61.44,22.23 v61.44,19.84 | v54.45,56.2 52.23,53.98 48.9,53.98 v48.42,54.45 | U$1.P$37 53.34,7.3 51.91,8.73 51.91,10.16 | v53.18,40.01 56.04,37.15 56.04,36.35 v56.83,35.56 | v60.8,16.67 61.44,16.67 62.55,15.56 IC8.16 60.8,12.22 53.98,12.22 51.91,10.16 | 51.91,10.16 INT.TP
  Bottom 0.152: R5.1 55.41,34.08 | 55.41,34.08 55.56,33.66 | 55.56,33.66 55.72,33.66 | U$2.40 55.4,53.82 54.45,54.77 v54.45,56.2 | 48.42,53.98 v48.42,54.45 48.42,43.18 51.59,40.01 v53.18,40.01 | 55.4,33.81 55.56,33.66 | 61.28,22.07 v61.44,22.23 60.95,22.71 55.95,22.71 54.37,24.29 54.37,27.54 53.66,28.26 53.66,30.32 54.29,30.96 54.29,33.03 R5.1 | R5.1 55.4,34.76 | v60.8,16.67 61.44,17.3 v61.44,19.84 | 55.41,34.08 55.99,34.08 56.83,34.92 v56.83,35.56
KEYBOARD_RX  (via drill 0.3, 0.35)
  Top 0.152: v73.82,25.4 74.28,25.86 74.28,39.69 74.25,39.69 70.33,43.61 70.33,48.58 | 70.33,48.58 v70.33,50.64 70.33,53.5 70.96,54.13 70.96,56.36 70.17,57.15 68.58,57.15 67.31,58.42 67.31,59.37 66.83,59.85 65.56,59.85 R16.1 | 70.33,48.58 69.53,48.58 69.06,48.1 69.06,46.99 v68.58,46.51 | U$1.P$43 60.96,9.45 61.59,10.08 67.33,10.08 v68.58,11.33
  Bottom 0.152: v73.82,25.4 74.06,25.16 74.06,21.67 73.03,20.64 73.03,15.88 73.82,15.08 73.82,12.86 73.18,12.22 71.75,12.22 71.12,11.59 68.84,11.59 v68.58,11.33 | U$2.20 68.84,50.64 v70.33,50.64 | JP1.1 63.66,36.67 63.66,41.91 65.64,43.89 66.12,43.89 68.58,46.35 v68.58,46.51
LED1  (via drill 0.35)
  Top 0.152: LED1.K 48.9,69.37 50.48,67.79 53.5,67.79 v56.52,64.77
  Bottom 0.152: v56.52,64.77 61.91,64.77 64.62,62.06 U$2.8
LED2  (via drill 0.35)
  Top 0.152: LED2.K 31.51,69.77 31.51,60.56 29.84,58.9 29.84,55.88 31.75,53.98 44.61,53.98 45.88,52.7 62.55,52.7 v63.82,53.98
  Bottom 0.152: U$2.22 67.5,49.02 66.04,50.48 64.93,50.48 63.82,51.59 v63.82,53.98
LEFT  (via drill 0.35)
  Top 0.152: RN1.4 15.05,64.93 21.27,64.93 21.75,64.45 U$16.16 v21.75,60.64
  Bottom 0.152: U$14.LEFT 1.68,61.84 3.49,63.66 7.49,63.66 RN1.4 | IC6.6 23.02,59.37 v21.75,60.64
M1  (via drill 0.35)
  Top 0.152: v60.48,31.59 61.28,30.8 61.28,28.26 62.23,27.3 65.72,27.3 66.52,26.51 66.52,18.26 65.56,17.3 57.47,17.3 56.36,18.41 55.56,18.41 53.02,15.88 51.75,15.88 51.12,15.24 51.12,12.54 49.5,10.93 49.5,8.39 48.26,7.14 U$1.P$33
  Bottom 0.152: IC8.27 59.85,31.59 v60.48,31.59
MCU_RST  (via drill 0.35)
  Top 0.152: v70.17,56.2 68.58,54.61 68.58,51.44 67.15,50.01 67.15,47.94 65.72,46.51 63.02,46.51 62.39,45.88 62.39,43.18 61.28,42.07 57.94,42.07 | 52.55,42.07 47.78,42.07 46.04,43.81 36.67,43.81 30.8,37.94 v30.8,36.83 | 52.55,42.07 57.94,42.07 | R12.1 59.37,42.08 57.94,42.07 | RST.1 52.55,42.07
  Bottom 0.152: U$2.13 70.14,56.22 v70.17,56.2 | v30.8,36.83 30.8,35.56 31.11,35.24 31.2,35.33 U$19.P$2
MENU  (via drill 0.35)
  Top 0.152: v28.1,60.48 U$16.11 28.1,64.58 RN1.9 | v28.89,40.48 28.89,37.39 27.5,36 23.86,36 23.18,35.31 U$5.P$1 | v26.35,40.48 24.47,42.36 24.47,45.85 v22.38,47.94
  Bottom 0.152: v26.35,40.48 v28.89,40.48 | v28.1,60.48 28.1,60.33 27.77,59.99 27.77,45.12 26.32,43.67 23.32,43.67 22.38,44.61 21.91,44.61 21.75,44.77 IC6.12 21.75,47.31 v22.38,47.94
MISO
  Bottom 0.152: SD_ADAPTER.P$3 50.96,51.44 49.37,53.02 49.37,63.02 52.39,66.04 62.55,66.04 67.02,61.56 U$2.11
MOSI
  Bottom 0.152: SD_ADAPTER.P$4 50.8,53.98 49.85,54.93 49.85,63.07 52.51,65.73 62.42,65.73 66.22,61.93 U$2.10
N$4  (via drill 0.35)
  Top 0.152: 68.92,40.78 R6.2 68.9,41.66 | Q1.2 69.22,39.69 68.9,40.01 68.9,41.66 | 68.9,41.66 68.52,41.66 v66.99,43.18
  Bottom 0.152: U$2.16 69.85,53.82 71.44,52.23 71.44,47.99 66.99,43.54 v66.99,43.18 | C1.1 71.75,39.18 Q1.2
N$5  (via drill 0.35)
  Top 0.152: Q1.1 66.07,41.05 R6.1 66.07,43.15 v66.04,43.18
  Bottom 0.152: U$2.17 69.85,53.02 71.12,51.75 71.12,48.26 v66.04,43.18 | C2.1 68.42,38.7 Q1.1
N$7  (via drill 0.35)
  Top 0.152: v4.76,61.59 4.76,64.61 3.17,66.2 3.17,71.75 ON.A
  Bottom 0.152: R15.2 4.76,60.01 v4.76,61.59
N$16
  Bottom 0.152: IC1.3 IC1.4 IC1.5
N$28  (via drill 0.35)
  Top 0.152: v45.24,67.31 46.35,68.42 LED1.A
  Bottom 0.152: v45.24,67.31 45.72,67.31 46.52,66.51 R1.1
N$39
  Bottom 0.152: IC1.6 38.1,23.34 38.42,23.02 45.4,23.02 45.72,23.34 IC7.2
N$41  (via drill 0.35)
  Top 0.152: v50.8,23.02 49.53,21.75 v49.53,20.16
  Bottom 0.152: IC7.6 v50.8,23.02 | IC7.12 46.99,19.68 47.47,20.16 v49.53,20.16 IC7.10
N$45
  Bottom 0.152: LED2.A 27.3,69.69 27.63,69.37 R2.1
N$52
  Bottom 0.152: IC7.9 50.8,20.16 50.16,20.8 40.01,20.8 39.37,20.16 IC1.8
N$55
  Top 0.152: CN1.D+ 38.1,66.04 38.42,65.72 | R7.1 45.93,59.45 45.49,59.45 44.61,60.33 44.61,62.87 43.97,63.5 | 43.97,63.5 43.97,65.41 43.66,65.72 38.42,65.72 | 38.42,65.72 | 43.97,63.5
N$56
  Top 0.152: CN1.D- 40.01,69.06 41.27,67.79 41.27,66.52 41.75,66.04 43.81,66.04 44.29,65.56 44.29,63.66 45.24,62.71 R8.1
NMI  (via drill 0.35)
  Top 0.152: IC8.17 65.09,13.49 63.18,11.59 55.09,11.59 53.5,10 v53.5,9.84 53.5,9.68 55.88,7.3 U$1.P$39 | R18.1 47.47,10 v48.26,9.21
  Bottom 0.152: v48.26,9.21 49.37,10.32 53.02,10.32 v53.5,9.84
RD  (via drill 0.3, 0.35)
  Top 0.152: v10.16,26.67 U$3.22 10.16,22.54 9.53,21.91 9.53,16.19 v9.21,15.88 | U$4.22 v10.16,38.73 13.41,35.48 17.07,35.48 17.78,34.77 19.84,34.77 20.48,34.13 30.48,34.13 31.91,35.56 31.91,38.42 36.82,43.33 39.67,43.33 39.69,43.34 45.88,43.34 47.64,41.58 61.75,41.58 62.87,42.69 62.87,45.4 v63.18,45.72 64.77,45.72 65.25,45.24 65.25,43.7 64.45,42.91 64.45,40.64 66.67,38.42 71.91,38.42 73.67,36.66 73.67,32.23 72.71,31.26 IC8.21
  Bottom 0.152: v10.16,26.67 v10.16,38.73 | v63.18,45.72 62.39,45.73 61.25,45.73 60.62,46.35 U$2.31 | v9.21,15.88 9.05,16.03 7.94,16.03 7.14,15.24 4.76,15.24 | RD.TP 4.76,16.67 4.76,15.24 | 4.76,15.24 4.76,10.79 7.62,7.94 9.68,7.94 10.16,7.46 U$1.P$4
RIGHT  (via drill 0.35)
  Top 0.152: RN1.5 17.27,65.25 22.54,65.25 23.02,64.77 U$16.15 v23.02,60.64
  Bottom 0.152: U$14.RIGHT 10.48,62.33 10.48,65.25 11.43,66.2 12.57,66.2 RN1.5 | IC6.7 24.29,59.37 v23.02,60.64
SCK
  Bottom 0.152: SD_ADAPTER.P$5 50.8,56.52 50.32,56.99 50.32,63.1 50.4,63.18 50.4,63.19 52.64,65.43 62.3,65.43 65.42,62.3 U$2.9
SCL  (via drill 0.3, 0.35)
  Top 0.152: U$13.P$3 37.94,62.07 33.97,62.07 v30.48,58.58 30.48,55.72 31.75,54.45 46.04,54.45 47.15,53.34 53.02,53.34 54.93,55.24 56.2,55.24 57.47,53.98 62.07,53.98 63.34,55.24 63.34,56.04 63.9,56.59 64.45,56.59 65.09,55.96 65.09,53.66 v66.04,52.7 | v12.06,51.75 11.75,51.75 9.37,54.13 6.19,54.13 5.71,53.66 v5.71,47.78 | v6.67,11.27 v2.86,11.27 | v35.4,60.01 v35.41,60 R14.1
  Bottom 0.152: IC4.14 39.21,36.2 32.54,42.86 23.65,42.86 22.23,44.29 19.68,44.29 19.21,44.77 IC6.14 19.21,47.62 17.62,49.21 13.65,49.21 12.06,50.8 v12.06,51.75 12.06,52.39 15.88,56.2 15.88,59.53 18.57,62.23 28.26,62.23 30.48,60.01 v30.48,58.58 30.48,57.63 30.8,57.31 31.91,57.31 34.61,60.01 v35.4,60.01 | v5.71,47.78 4.92,46.99 IC5.14 4.92,44.93 4.13,44.13 3.02,44.13 1.75,42.86 1.75,12.38 v2.86,11.27 | U$2.18 67.31,52.22 66.83,52.7 v66.04,52.7 | U$1.P$26 38.1,7.46 37.78,7.78 35.67,7.78 33.77,9.68 9.05,9.68 7.46,11.27 v6.67,11.27
SDA  (via drill 0.3, 0.35)
  Top 0.152: v3.81,47.78 3.81,50.16 5.41,51.77 5.41,53.98 5.89,54.45 9.84,54.45 v11.43,52.86 | U$13.P$4 40.18,61.77 40.16,61.77 | v66.36,51.75 66.75,52.15 66.75,53.02 65.52,54.25 65.52,56.16 64.69,56.99 63.66,56.99 63.02,56.36 63.02,55.4 61.91,54.29 57.78,54.29 56.52,55.56 54.61,55.56 52.7,53.66 47.47,53.66 46.35,54.77 32.07,54.77 31.11,55.72 v31.11,57.94 31.11,58.74 34.14,61.77 39.85,61.77 40.16,61.77 | v3.65,10.48 v7.3,10.48 | R13.1 40.48,61.45 40.16,61.77
  Bottom 0.152: IC4.15 37.94,37.03 32.42,42.56 23.48,42.56 22.07,43.97 19.37,43.97 18.89,44.45 18.26,44.45 17.94,44.77 IC6.15 17.94,47.62 16.67,48.9 13.34,48.9 11.11,51.12 11.11,52.55 v11.43,52.86 11.91,52.86 15.56,56.52 15.56,59.69 18.41,62.55 28.57,62.55 31.11,60.01 v31.11,57.94 | v3.81,47.78 3.65,47.62 IC5.15 3.65,44.77 3.33,44.45 2.86,44.45 1.43,43.02 1.43,11.59 2.54,10.48 v3.65,10.48 | U$2.19 67.15,51.42 66.82,51.75 v66.36,51.75 | U$1.P$24 35.56,7.46 33.66,9.37 8.41,9.37 v7.3,10.48
SLOWCLK  (via drill 0.3, 0.35)
  Top 0.152: v56.83,36.35 56.83,37.78 v57.63,38.58
  Bottom 0.152: IC7.1 44.45,26.67 44.93,27.15 47.47,27.15 48.58,28.26 48.58,30.64 46.99,32.23 46.99,33.97 47.47,34.45 50.32,34.45 51.75,35.88 55.88,35.88 56.36,36.35 v56.83,36.35 | R10.2 57.31,38.26 v57.63,38.58 59.02,39.97 U$2.33
START  (via drill 0.35)
  Top 0.152: RN1.8 22.07,67.79 23.65,66.2 25.4,66.2 26.83,64.77 U$16.12 v26.83,60.64 26.19,60.01 18.41,60.01 16.68,58.27 15.43,58.27 13.81,56.65 13.81,51.91 17.39,48.33 U$6.P$2
  Bottom 0.152: IC6.11 23.02,44.61 23.65,43.97 26.19,43.97 27.46,45.24 27.46,60.01 v26.83,60.64
TIMER4
  Bottom 0.152: U$2.32 59.85,47.2 59.85,46.35 59.37,45.88 59.37,38.42 61.78,36.01 61.78,33.72 JP2.1
UCAP
  Bottom 0.254: U$2.6 63.02,63.02 62.07,63.98 55.24,63.98 54.77,64.45 C8.1
UP  (via drill 0.35)
  Top 0.152: RN1.2 6.83,67.15 7.62,66.36 9.84,66.36 10.48,65.72 10.48,63.82 11.27,63.02 12.7,63.02 13.97,64.29 18.89,64.29 19.21,63.98 U$16.18 v19.21,60.64
  Bottom 0.152: U$14.UP 4.2,64.53 6.83,67.15 RN1.2 | IC6.4 20.48,59.37 v19.21,60.64
VBUS
  Bottom 1.016: 39.7,66.69 39.69,66.67
  Bottom 1.27: 39.7,66.69 CN1.VBUS 43.18,67.75 44.19,68.76 73.48,68.76 75.18,67.06 75.18,63.34 | U$18.P$4 74.64,55.34 75.18,55.88 75.18,63.34 | JP3.1 75.18,63.34
VCC  (via drill 0.3, 0.35)
  Top 0.152: v9.37,60.01 5.71,60.01 | R17.2 58.74,38.58 57.47,37.31 57.47,34.77 56.36,33.66 | IC8.11 49.53,13.97 46.91,11.35 45.01,11.35 R18.2 44.14,10.01 | v68.58,62.71 v68.57,62.7 R16.2
  Top 0.254: v53.98,34.13 55.88,34.13 56.36,33.66 v57.78,32.23
  Top 0.508: U$3.28 2.54,26.67 1.43,27.78 1.43,33.81 2.54,34.92 v2.54,38.73 U$4.28 2.54,41.59 1.98,42.15 1.98,49.29 2.38,49.69 v2.38,51.12 v2.38,53.5 2.38,54.29 5.71,57.63 5.71,60.01 5.71,61.91 | RN1.1 4.29,66.04 5.71,64.61 5.71,61.91 | 16.67,59.85 14.45,62.07 C4.1 5.87,62.07 5.71,61.91 | 16.67,59.85 U$16.20 | v16.99,59.53 16.67,59.85 | 54.14,45.08 v54.13,45.09 54.13,44.61 55.24,43.5 R12.2 | v42.55,57.15 R13.2 R14.2
  Top 0.61: 49.85,18.1 IC8.11 | v60.17,23.81 v60.17,24.61 v60.17,25.4 | 45.56,20.16 44.61,21.11 34.45,21.11 33.5,20.16 v31.75,20.16 | 45.56,20.16 47.62,18.1 49.85,18.1 | v44.45,20.16 45.56,20.16 | v60.17,23.81 60.17,21.11 59.53,20.48 58.1,20.48 56.83,21.75 55.24,21.75 51.59,18.1 49.85,18.1 | v60.17,23.81 61.44,23.81 62.55,22.7 v62.55,20.16
  Bottom 0.152: R15.1 v9.37,60.01 | v68.58,62.71 69.69,62.71
  Bottom 0.254: R3.2 58.89,25.09 56.2,27.78 56.2,30.8 v57.78,32.23 | R5.2 52.71,33.81 53.66,33.81 v53.98,34.13
  Bottom 0.508: IC2.16 v62.55,20.16 | IC7.14 v44.45,20.16 | v31.75,20.16 IC1.14 | IC5.16 v2.38,51.12 6.19,51.12 7.3,50.01 9.37,50.01 11.11,48.26 15.56,48.26 16.67,47.15 IC6.16 16.67,44.61 18.25,43.03 19.41,41.76 20.53,41.75 22.07,41.75 | IC4.16 36.67,37.15 32.07,41.75 22.07,41.75 | 52.07,48.74 SD_ADAPTER.P$2 53.34,48.9 54.13,48.1 54.13,46.83 | U$2.24 66.22,49.05 65.43,49.85 64.45,49.85 62.87,51.44 62.87,54.77 | 61.39,55.42 62.23,55.42 | 61.39,55.42 60.48,54.51 60.48,49.69 59.82,49.02 58.26,49.02 | 62.23,55.42 62.87,54.77 | 61.39,55.42 59.82,56.99 U$2.2 59.82,60.35 59.37,60.8 56.83,60.8 55.88,59.85 55.88,57.31 56.17,57.02 U$2.44 | IC5.1 v2.38,53.5 | 29.69,64.93 32.78,61.83 36.83,61.83 | IC6.2 17.94,58.58 v16.99,59.53 | 71.28,55.4 71.26,55.42 U$2.14 65.11,55.42 64.45,54.77 62.87,54.77 | 13.81,62.07 C4.1 14.45,62.07 17.3,64.93 29.69,64.93 | R2.2 30.47,65.72 29.69,64.93 | 58.26,49.02 U$2.34 | R11.2 54.93,44.14 54.13,44.93 v54.13,45.09 54.13,46.83 | R3.2 60.17,24.92 | 36.83,61.83 43.18,61.83 | 43.18,61.83 46.28,61.83 49.36,64.92 | U$13.P$2 36.83,61.83 | C3.1 22.07,41.75 | 43.18,61.83 43.18,57.78 v42.55,57.15 | 62.23,55.42 63.82,57.02 U$2.7 | 54.13,46.83 56.07,46.83 58.26,49.02
  Bottom 0.61: v60.17,23.81 v60.17,24.61 60.17,24.92 v60.17,25.4 60.17,26.67 60.8,27.3 75.18,27.3
  Bottom 1.016: U$18.P$3 72.55,53.34 71.28,54.61 71.28,55.4 71.28,58.42 C5.1 69.69,60.17 69.69,62.71 69.69,64.45 67.15,66.99 50.79,66.99 R1.2 49.36,64.92
  Bottom 1.27: U$1.P$50 68.58,7.62 70.33,9.37 73.03,9.37 | 73.03,9.37 73.66,9.37 75.18,10.89 75.18,12.22 | U$18.P$3 74.55,53.34 75.18,52.7 75.18,45.34 | 75.18,12.22 75.18,27.3 75.18,43.66 | 75.18,12.22 74.77,11.81 C6.1 73.03,9.37 | 75.18,43.66 C7.+ 75.18,45.34 | 75.18,43.66 75.18,45.34
WAIT  (via drill 0.3, 0.35)
  Top 0.152: v55.72,9.53 57.31,11.11 64.45,11.11 66.36,13.02 66.36,16.99 67.31,17.94 | IC8.24 67.31,26.99 67.31,17.94 | R17.1 63.5,37.3 63.5,36.67 63.02,36.2 63.02,32.23 63.48,31.77 v67.15,31.77 | 67.31,17.94
  Bottom 0.152: v55.72,9.53 55.39,9.2 53.53,9.2 52.59,8.26 46.83,8.26 45.72,7.14 U$1.P$32 | IC8.24 67.15,31.27 v67.15,31.77 67.15,31.91
WR  (via drill 0.3, 0.35)
  Top 0.152: v3.81,26.67 U$3.27 3.81,22.38 3.17,21.75 v3.17,15.88 | U$4.27 v3.81,38.73 4.76,37.78 10.64,37.78 13.34,35.08 16.99,35.08 17.62,34.45 19.53,34.45 20.32,33.66 30.48,33.66 32.23,35.4 32.23,38.3 36.94,43.02 45.72,43.02 47.47,41.27 61.91,41.27 63.18,42.55 63.18,44.45 63.66,44.93 v64.61,44.93 64.61,43.66 64.14,43.18 64.14,40.48 66.52,38.1 71.75,38.1 73.37,36.49 73.37,32.41 IC8.22
  Bottom 0.152: v3.81,26.67 v3.81,38.73 | v64.61,44.93 U$2.26 | U$1.P$2 7.62,7.46 4.45,10.64 4.45,15.4 3.97,15.88 v3.17,15.88 WR.TP
Z80CLK  (via drill 0.35)
  Top 0.152: v51.59,21.11 51.59,23.34 51.12,23.81 50.48,23.81 49.21,22.54 v46.99,22.54 | U$1.P$41 58.42,8.41 57.94,8.89 55.24,8.89 v54.45,9.84 | IC8.6 37.15,13.18 36.2,12.22 v36.2,9.21
  Bottom 0.152: IC8.6 39.45,16.27 51.83,16.27 53.02,17.46 53.02,19.68 v51.59,21.11 | v46.99,22.54 IC7.3 | v36.2,9.21 45.4,9.21 46.83,10.64 53.82,10.64 v54.45,9.84
Z80RESET  (via drill 0.3, 0.35)
  Top 0.152: IC8.26 60.01,30.64 59.05,31.59 57.31,31.59 55.56,33.34 53.18,33.34 52.7,33.81 52.7,37.94 51.04,39.61 45.96,39.61 45.88,39.53 | 45.88,39.53 45.88,36.35 46.43,35.8 47.57,35.8 U$17.P$2 | v34.92,36.51 39.53,41.12 45.09,41.12 45.88,40.32 45.88,39.53 | v59.69,50.01 60.17,49.53 v60.17,45.72 59.53,45.09 v57.94,45.09 | v21.27,22.86 22.07,22.07 25.42,22.07 30.03,17.46 34.11,17.46 34.77,18.12 44.9,18.12 46.04,16.99 46.04,13.02 45.24,12.22 43.81,12.22 43.34,11.75 42.07,11.75 41.27,10.95 v41.27,7.94
  Bottom 0.152: U$2.1 59.02,56.55 59.69,55.88 v59.69,50.01 | v60.17,45.72 59.69,45.24 59.69,38.58 63.02,35.24 63.02,32.23 IC8.26 | U$1.P$28 40.64,7.3 v41.27,7.94 | v34.92,36.51 34.92,35.56 30.48,31.11 23.89,31.11 23.26,30.48 23.26,28.18 22.7,27.62 21.75,27.62 21.11,26.99 21.11,26.19 21.59,25.72 21.59,23.18 v21.27,22.86 | v57.94,45.09 57.78,44.93 R11.1

## Text on the board
tPlace: USB | TX | RX | A | B | ON | JOYSTICK | ADD R14/R15 ONLY IF | NOT ATTACHING I2C OLED | PORT $90 | MENU | SSD1306 128X64 I2C OLED | START | Z80 | RESET | 64K SRAM | Z80 CPU
bPlace: GND | GND | USB | SOLDER | SIDE | AUXPOW | 5VDC | /SDCS | GND | SCK | MOSI | ICSP | MISO | VCC | GND | TIMER4 | 16MHZ | MCU RESET | NAND | OR | 3:8 MUX | WWW.BENHECK.COM